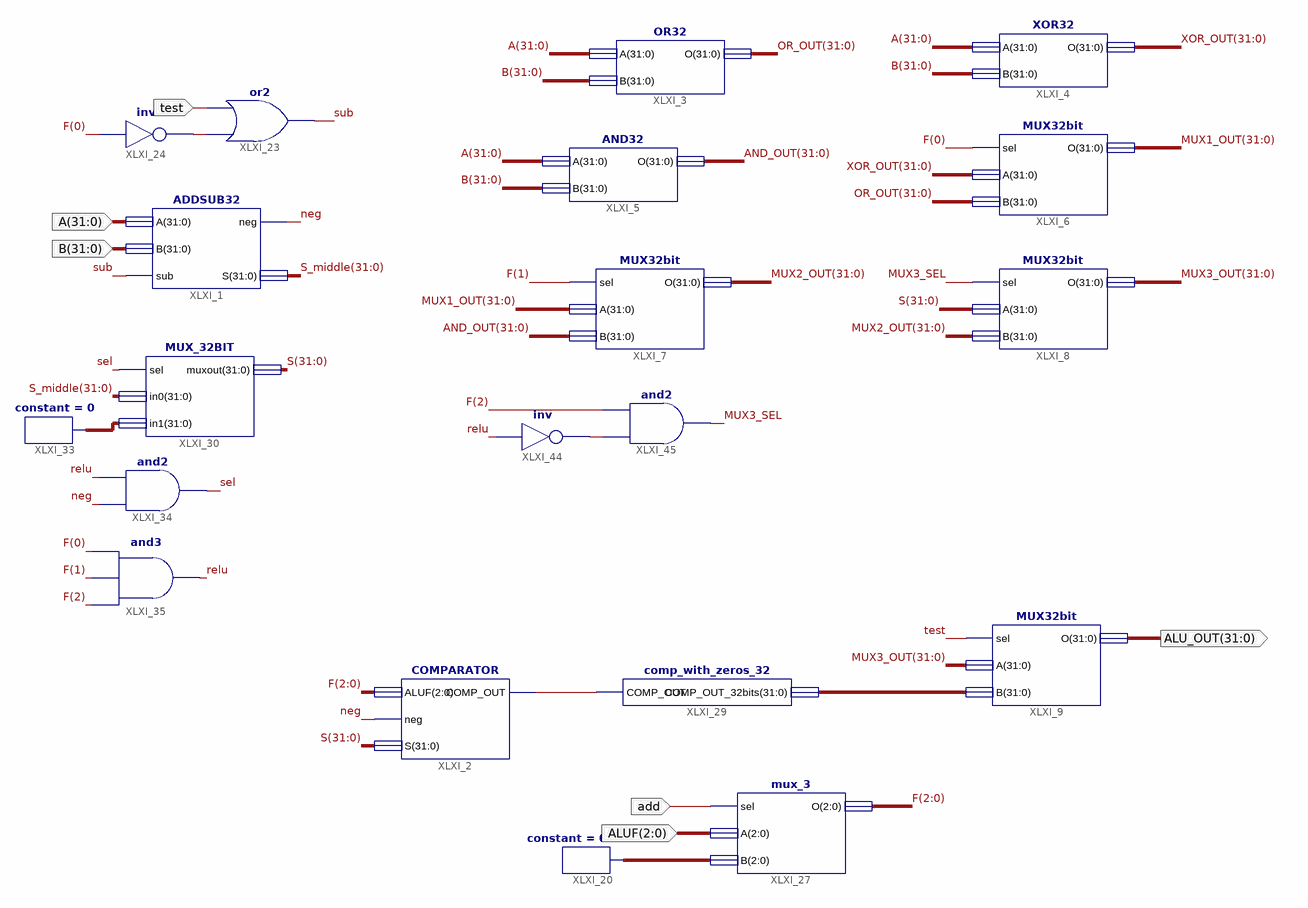
[diagram p0: schematic sheet 1]
// Xilinx ISE schematic ALU_DLX.sch (spartan6) as structural Verilog: 20 symbols, 6 ports
module ALU_DLX (
  input  [31:0] A,
  input  [31:0] B,
  input  test,
  input  add,
  input  [2:0] ALUF,
  output [31:0] ALU_OUT
);

  wire MUX3_SEL, neg, relu, sel, sub, XLXN_79, XLXN_147, XLXN_149;
  wire [2:0] F, XLXN_73;
  wire [31:0] AND_OUT, MUX1_OUT, MUX2_OUT, MUX3_OUT, OR_OUT, S, S_middle, XLXN_5, XLXN_148, XOR_OUT;

  ADDSUB32 XLXI_1 (.sub(sub), .B(B), .A(A), .S(S_middle), .neg(neg));
  OR32 XLXI_3 (.A(A), .B(B), .O(OR_OUT));
  XOR32 XLXI_4 (.A(A), .B(B), .O(XOR_OUT));
  MUX32bit XLXI_8 (.sel(MUX3_SEL), .A(S), .B(MUX2_OUT), .O(MUX3_OUT));
  MUX32bit XLXI_7 (.sel(F[1]), .A(MUX1_OUT), .B(AND_OUT), .O(MUX2_OUT));
  AND32 XLXI_5 (.A(A), .B(B), .O(AND_OUT));
  MUX32bit XLXI_6 (.sel(F[0]), .A(XOR_OUT), .B(OR_OUT), .O(MUX1_OUT));
  not XLXI_24 (XLXN_79, F[0]);
  or XLXI_23 (sub, XLXN_79, test);
  MUX_32BIT XLXI_30 (.sel(sel), .in0(S_middle), .in1(XLXN_5), .muxout(S));
  constant #(.CValue("0")) XLXI_33 (.O(XLXN_5));
  and XLXI_34 (sel, neg, relu);
  and XLXI_35 (relu, F[2], F[1], F[0]);
  constant #(.CValue("00000003")) XLXI_20 (.O(XLXN_73));
  mux_3 XLXI_27 (.sel(add), .A(ALUF), .B(XLXN_73), .O(F));
  comp_with_zeros_32 XLXI_29 (.COMP_OUT(XLXN_147), .COMP_OUT_32bits(XLXN_148));
  COMPARATOR XLXI_2 (.ALUF(F), .neg(neg), .S(S), .COMP_OUT(XLXN_147));
  MUX32bit XLXI_9 (.sel(test), .A(MUX3_OUT), .B(XLXN_148), .O(ALU_OUT));
  not XLXI_44 (XLXN_149, relu);
  and XLXI_45 (MUX3_SEL, XLXN_149, F[2]);
endmodule
